# Altium project Drone_FCC.PrjPcb (part 2 of 2)

## Sheet Sensors.SchDoc
size A4; SheetNumber: 4; SheetTotal: 6
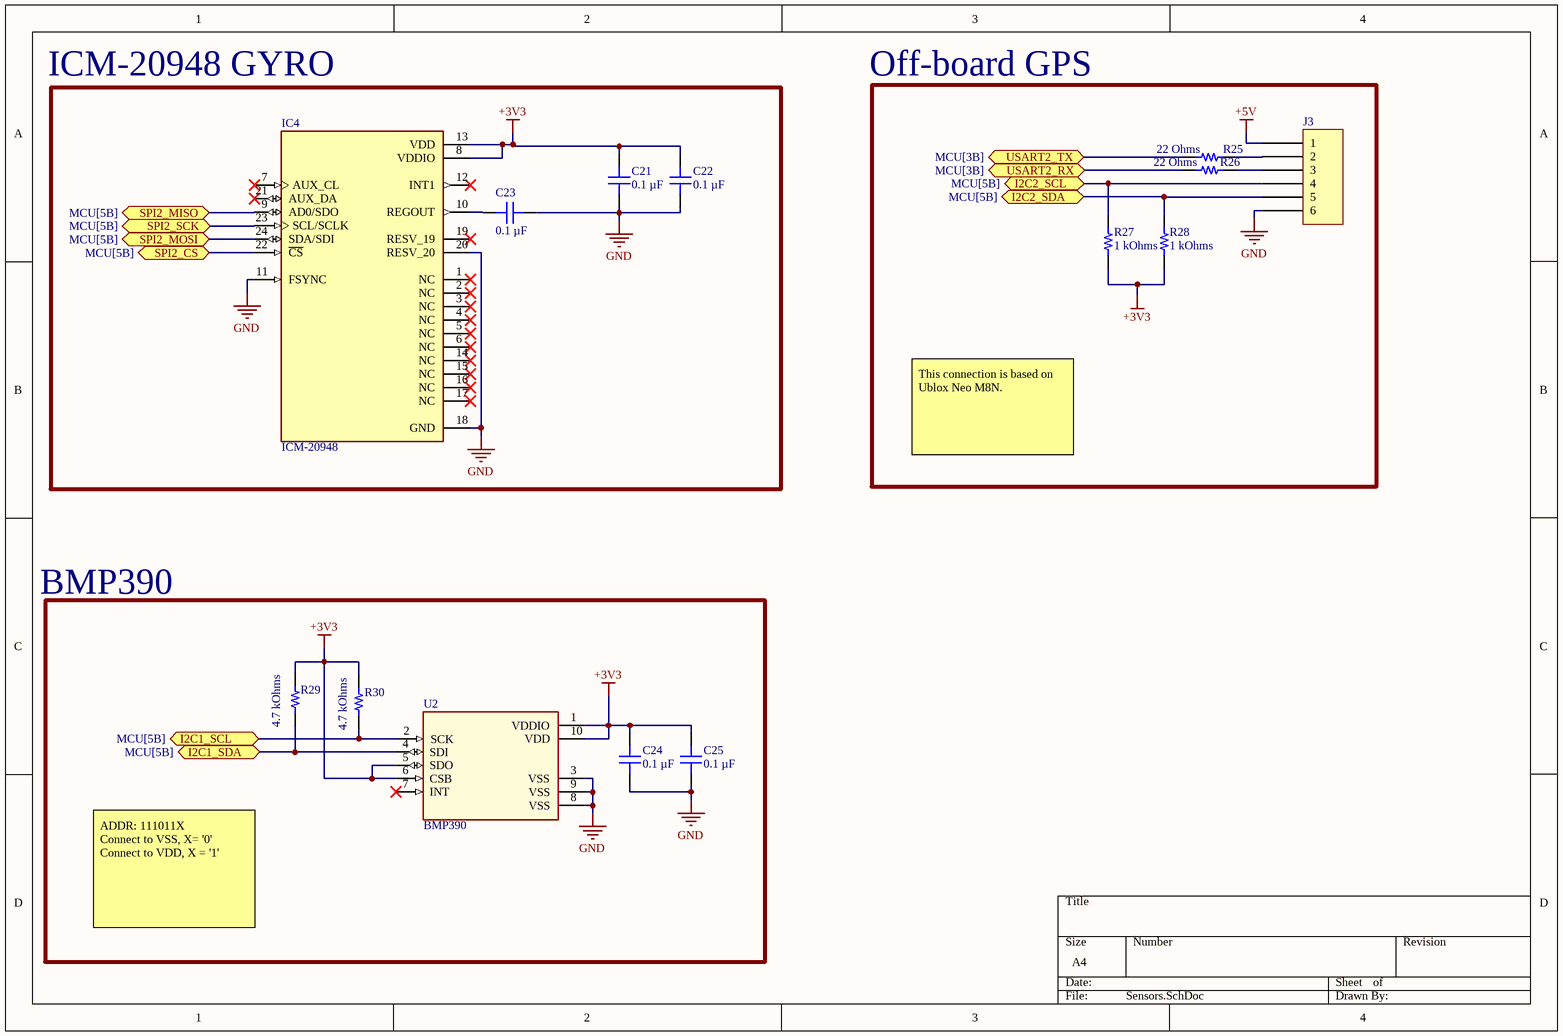
[diagram p3: Sensors.SchDoc]

### Parts
C21  0.1 µF  [CAP 0603_1608]
C22  0.1 µF  [CAP 0603_1608]
C23  0.1 µF  [CAP 0603_1608]
C24  0.1 µF  [CAP 0603_1608]
C25  0.1 µF  [CAP 0603_1608]
IC4  ICM-20948  [ICM-20948]
J3  SM06B-SRSS-TB(LF)(SN)  [JST SM06B-SRSS-TB]  (value not drawn)
R25  22 Ohms  [YAGEO RES 0402_1005]
R26  22 Ohms  [YAGEO RES 0402_1005]
R27  1 kOhms  [YAGEO RES 0402_1005]
R28  1 kOhms  [YAGEO RES 0402_1005]
R29  4.7 kOhms  [YAGEO RES 0402_1005]
R30  4.7 kOhms  [YAGEO RES 0402_1005]
U2  BMP390  [BMP390]

### Blocks framed on the sheet
Off-board GPS: J3 R25-R28
ICM-20948 GYRO: C21-C23 IC4

### Ports
I2C1_SCL (bidir, see MCU[5B]), I2C1_SDA (bidir, see MCU[5B]), I2C2_SCL (bidir, see MCU[5B]), I2C2_SDA (bidir, see MCU[5B]), SPI2_CS (bidir, see MCU[5B]), SPI2_MISO (bidir, see MCU[5B]), SPI2_MOSI (bidir, see MCU[5B]), SPI2_SCK (bidir, see MCU[5B]), USART2_RX (bidir, see MCU[3B]), USART2_TX (bidir, see MCU[3B])

### Nets
+3V3: C21.2 C22.2 C24.2 C25.2 IC4.8(VDDIO) IC4.13(VDD) R27.1 R28.1 R29.2 R30.2 U2.1(VDDIO) U2.5(SDO) U2.6(CSB) U2.10(VDD)
+5V: J3.1
GND: C21.1 C22.1 C23.1 C24.1 C25.1 IC4.11(FSYNC) IC4.18(GND) IC4.20(RESV_20) J3.6 U2.3(VSS) U2.8(VSS) U2.9(VSS)
I2C1_SCL: R30.1 U2.2(SCK) ; port I2C1_SCL
I2C1_SDA: R29.1 U2.4(SDI) ; port I2C1_SDA
I2C2_SCL: J3.4 R27.2 ; port I2C2_SCL
I2C2_SDA: J3.5 R28.2 ; port I2C2_SDA
SPI2_CS: IC4.22(~{CS}) ; port SPI2_CS
SPI2_MISO: IC4.9(AD0/SDO) ; port SPI2_MISO
SPI2_MOSI: IC4.24(SDA/SDI) ; port SPI2_MOSI
SPI2_SCK: IC4.23(SCL/SCLK) ; port SPI2_SCK
USART2_RX: R26.1 ; port USART2_RX
USART2_TX: R25.1 ; port USART2_TX
NetC23_2: C23.2 IC4.10(REGOUT)
NetJ3_2: J3.2 R25.2
NetJ3_3: J3.3 R26.2

Not connected (* = marked no-connect by the designer): IC4 1(NC)* 2(NC)* 3(NC)* 4(NC)* 5(NC)* 6(NC)* 7(AUX_CL)* 12(INT1)* 14(NC)* 15(NC)* 16(NC)* 17(NC)* 19(RESV_19)* 21(AUX_DA)*; U2 7(INT)*

### Notes on the sheet
- This connection is based on Ublox Neo M8N.
- BMP390
- ADDR: 111011X
  Connect to VSS, X= '0'
  Connect to VDD, X = '1'

### Library data of the parts
C21-C25 = GCJ188R71C104KA01D: CAP CER 0.1UF 16V X7R 0603; manufacturer: Murata Electronics; Tolerance: ±10%; Part Number: GCJ188R71C104KA01D; Capacitance: 0.1 µF; Applications: Automotive, Boardflex Sensitive; componentlink1description: Datasheet; componentlink1url: https://www.murata.com/~/media/webrenewal/support/library/catalog/products/capacitor/mlcc/c03e.ashx?la=en-us; componentlink2description: DigiKey Link; componentlink2url: https://www.digikey.com/en/products/detail/murata-electronics/GCJ188R71C104KA01D/2783813; Device Package: 0603 (1608 Metric); Features: Soft Termination; lastupdated: 9.02.2024 20:10:06; Lifecycle Status: Active; Minimum Order: 1; Mounting Type: Surface Mount, MLCC; Operating Temperature: -55°C ~ 125°C; Package / Case: 0603 (1608 Metric); packaging: TapeAndReel; partid: 17928; Part Status: Active; price: 0.02; Ratings: AEC-Q200; series: GCJ; Size / Dimension: 0.063" L x 0.031" W (1.60mm x 0.80mm); Supplier 1: DigiKey; Supplier Part Number 1: 490-5796-1-ND; Temperature Coefficient: X7R; Thickness (Max): 0.035" (0.90mm); value: 0.1 µF; Voltage - Rated: 16V
IC4 = ICM-20948: Accelerometer, Gyroscope, Magnetometer, 9 Axis Sensor I2C, SPI Output; Parameter 4: Package / Case; Sensor Type: Accelerometer, Gyroscope, Magnetometer, 9 Axis; Output Type: I2C, SPI; Operating Temperature: -40°C ~ 85°C
J3 = SM06B-SRSS-TB(LF)(SN): CONN HEADER SMD R/A 6POS 1MM; Manufacturer: JST Sales America Inc.; Current Rating (Amps): 0.7A; Material Flammability Rating: UL94 V-0; Number of Positions: 6; Number of Positions Loaded: All; Pitch - Mating: 0.039" (1.00mm); Shrouding: Shrouded - 4 Wall; Style: Board to Cable/Wire; Voltage Rating: 50V; Part Number: SM06B-SRSS-TB(LF)(SN); ComponentLink1Description: Datasheet; ComponentLink1URL: http://www.jst-mfg.com/product/pdf/eng/eSH.pdf; ComponentLink2Description: DigiKey Link; ComponentLink2URL: http://digikey.com/product-detail/en/jst-sales-america-inc/SM06B-SRSS-TB-LF-SN/455-1806-1-ND/926877; Connector Type: Header; Contact Finish - Mating: Tin; Contact Finish - Post: Tin; Contact Material: Copper Alloy; Contact Shape: Square; Contact Type: Male Pin; Fastening Type: Push-Pull; Features: Solder Retention; Insulation Color: Natural; Insulation Height: 0.114" (2.90mm); Insulation Material: Polyamide (PA), Nylon; LastUpdated: 12.01.2020 23:42:14; Lifecycle Status: Active; Minimum Order: 1; Mounting Type: Surface Mount, Right Angle; Number of Rows: 1; Operating Temperature: -25°C ~ 85°C; Packaging: TapeAndReel; PartId: 64; Part Status: Active; Price: 0.36; Series: SR; Supplier 1: DigiKey; Supplier Part Number 1: 455-1806-1-ND; Termination: Solder
R25 R26 = AC0402JR-0722RL: RES SMD 22 OHM 5% 1/16W 0402; Manufacturer: Yageo; Power (Watts): 0.063W, 1/16W; Temperature Coefficient: ±100ppm/°C; Part Number: AC0402JR-0722RL; Value: 22 Ohms; ComponentLink1Description: Datasheet; ComponentLink1URL: https://www.yageo.com/upload/media/product/productsearch/datasheet/rchip/PYu-AC_51_RoHS_L_7.pdf; ComponentLink2Description: DigiKey Link; ComponentLink2URL: https://www.digikey.com/en/products/detail/yageo/AC0402JR-0722RL/5895625; Composition: Thick Film; Device Package: 0402 (1005 Metric); Features: Automotive AEC-Q200, Moisture Resistant; Height - Seated (Max): 0.015" (0.37mm); LastUpdated: 25.07.2024 09:18:12; Lifecycle Status: Active; Minimum Order: 1; Number of Terminations: 2; Operating Temperature: -55°C ~ 155°C; Package / Case: 0402 (1005 Metric); Packaging: CutTape; PartId: 15641; Part Status: Active; Price: 0.01; Ratings: AEC-Q200; Resistance: 22 Ohms; Series: AC; Size / Dimension: 0.039" L x 0.020" W (1.00mm x 0.50mm); Supplier 1: DigiKey; Supplier Part Number 1: YAG3533CT-ND; Supplier Device Package: 0402; Tolerance: ±5%
R27 R28 = AC0402JR-071KL: RES SMD 1K OHM 5% 1/16W 0402; Manufacturer: Yageo; Power (Watts): 0.063W, 1/16W; Temperature Coefficient: ±100ppm/°C; Part Number: AC0402JR-071KL; Value: 1 kOhms; ComponentLink1Description: Datasheet; ComponentLink1URL: https://www.yageo.com/upload/media/product/productsearch/datasheet/rchip/PYu-AC_51_RoHS_L_7.pdf; ComponentLink2Description: DigiKey Link; ComponentLink2URL: https://www.digikey.com/en/products/detail/yageo/AC0402JR-071KL/5895603; Composition: Thick Film; Device Package: 0402 (1005 Metric); Features: Automotive AEC-Q200, Moisture Resistant; Height - Seated (Max): 0.015" (0.37mm); LastUpdated: 25.07.2024 09:18:18; Lifecycle Status: Active; Minimum Order: 1; Number of Terminations: 2; Operating Temperature: -55°C ~ 155°C; Package / Case: 0402 (1005 Metric); Packaging: CutTape; PartId: 3403; Part Status: Active; Price: 0.01; Ratings: AEC-Q200; Resistance: 1 kOhms; Series: AC; Size / Dimension: 0.039" L x 0.020" W (1.00mm x 0.50mm); Supplier 1: DigiKey; Supplier Part Number 1: YAG3525CT-ND; Supplier Device Package: 0402; Tolerance: ±5%
R29 R30 = RT0402FRE074K7L: RES SMD 4.7K OHM 1% 1/16W 0402; Manufacturer: Yageo; Power (Watts): 0.063W, 1/16W; Temperature Coefficient: ±50ppm/°C; Part Number: RT0402FRE074K7L; Value: 4.7 kOhms; ComponentLink1Description: Datasheet; ComponentLink1URL: https://www.yageo.com/upload/media/product/productsearch/datasheet/rchip/PYu-RT_1-to-0.01_RoHS_L_11.pdf; ComponentLink2Description: DigiKey Link; ComponentLink2URL: https://www.digikey.com/en/products/detail/yageo/RT0402FRE074K7L/1072052; Composition: Thin Film; Device Package: 0402 (1005 Metric); Height - Seated (Max): 0.014" (0.35mm); LastUpdated: 25.07.2024 09:18:18; Lifecycle Status: Active; Minimum Order: 1; Number of Terminations: 2; Operating Temperature: -55°C ~ 155°C; Package / Case: 0402 (1005 Metric); Packaging: TapeAndReel; PartId: 3198; Part Status: Active; Price: 0.01; Resistance: 4.7 kOhms; Series: RT; Size / Dimension: 0.039" L x 0.020" W (1.00mm x 0.50mm); Supplier 1: DigiKey; Supplier Part Number 1: YAG3347CT-ND; Supplier Device Package: 0402; Tolerance: ±1%
U2 = BMP390: Pressure Sensor 4.35PSI ~ 18.13PSI (30kPa ~ 125kPa) Absolute 10-WFLGA; Manufacturer: Bosch Sensortech; Output Type: I2C, SPI; Accuracy: ±0.01PSI (0.05kPa); Voltage Supply: 1.65V ~ 3.6V; Maximum Pressure: 290.08PSI (2000kPa); Operating Pressure: 4.35PSI ~ 18.13PSI (30kPa ~ 125kPa); Operating Temperature: -40°C ~ 85°C (TA); Package / Case: 10-WFLGA; ComponentLink1Description: Datasheet; ComponentLink1URL: https://www.bosch-sensortec.com/media/boschsensortec/downloads/datasheets/bst-bmp390-ds002.pdf; ComponentLink2Description: Digikey Link; ComponentLink2URL: https://www.digikey.com/en/products/detail/bosch-sensortec/bmp390/16164575

## Sheet MCU.SchDoc
size 350 x 200 mm; SheetNumber: 5; SheetTotal: 6
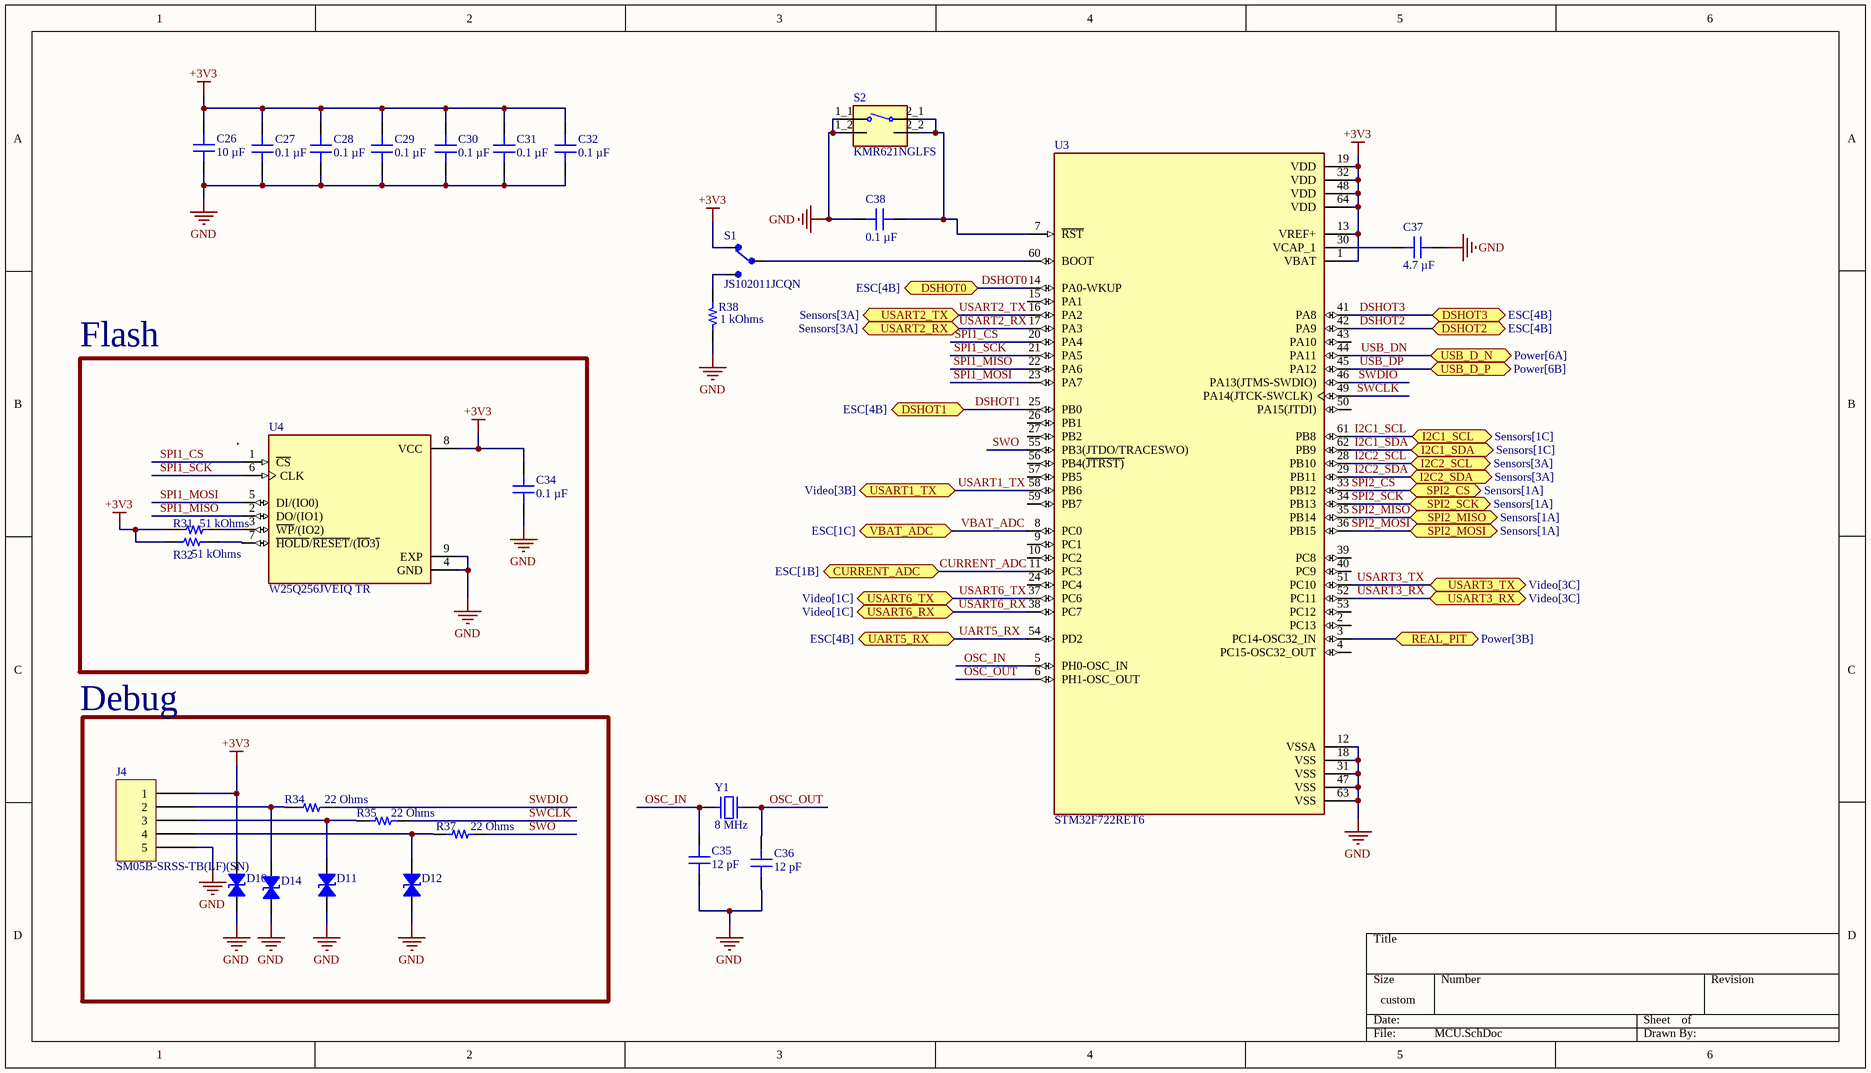
[diagram p4: MCU.SchDoc]

### Parts
C26  10 µF  [CAP 0402_1005]
C27  0.1 µF  [CAP 0402_1005]
C28  0.1 µF  [CAP 0402_1005]
C29  0.1 µF  [CAP 0402_1005]
C30  0.1 µF  [CAP 0402_1005]
C31  0.1 µF  [CAP 0402_1005]
C32  0.1 µF  [CAP 0402_1005]
C34  0.1 µF  [CAP 0603_1608]
C35  12 pF  [CAP 0402_1005]
C36  12 pF  [CAP 0402_1005]
C37  4.7 µF  [CAP 0402_1005]
C38  0.1 µF  [CAP 0402_1005]
D10  DESD5V0U1BA-7  [SOD323]  (value not drawn)
D11  DESD5V0U1BA-7  [SOD323]  (value not drawn)
D12  DESD5V0U1BA-7  [SOD323]  (value not drawn)
D14  DESD5V0U1BA-7  [SOD323]  (value not drawn)
J4  SM05B-SRSS-TB(LF)(SN)  [JST SM05B-SRSS-TB]
R31  51 kOhms  [RES 0603_1608]
R32  51 kOhms  [RES 0603_1608]
R34  22 Ohms  [YAGEO RES 0402_1005]
R35  22 Ohms  [YAGEO RES 0402_1005]
R37  22 Ohms  [YAGEO RES 0402_1005]
R38  1 kOhms  [YAGEO RES 0402_1005]
S1  JS102011JCQN  [JS102011JCQN]
S2  KMR621NGLFS  [KMR621NGLFS]
U3  STM32F722RET6  [STM32F722RET6]
U4  W25Q256JVEIQ TR  [W25Q256JVEIQ TR]
Y1  8 MHz  [NDK NX3225GD]

### Blocks framed on the sheet
Flash: C34 R31 R32 U4
Debug: D10-D12 D14 J4 R34 R35 R37

### Ports
CURRENT_ADC (bidir, see ESC[1B]), DSHOT0 (bidir, see ESC[4B]), DSHOT1 (bidir, see ESC[4B]), DSHOT2 (bidir, see ESC[4B]), DSHOT3 (bidir, see ESC[4B]), I2C1_SCL (bidir, see Sensors[1C]), I2C1_SDA (bidir, see Sensors[1C]), I2C2_SCL (bidir, see Sensors[3A]), I2C2_SDA (bidir, see Sensors[3A]), REAL_PIT (bidir, see Power[3B]), SPI2_CS (bidir, see Sensors[1A]), SPI2_MISO (bidir, see Sensors[1A]), SPI2_MOSI (bidir, see Sensors[1A]), SPI2_SCK (bidir, see Sensors[1A]), UART5_RX (bidir, see ESC[4B]), USART1_TX (bidir, see Video[3B]), USART2_RX (bidir, see Sensors[3A]), USART2_TX (bidir, see Sensors[3A]), USART3_RX (bidir, see Video[3C]), USART3_TX (bidir, see Video[3C]), USART6_RX (bidir, see Video[1C]), USART6_TX (bidir, see Video[1C]), USB_D_N (bidir, see Power[6A]), USB_D_P (bidir, see Power[6B]), VBAT_ADC (bidir, see ESC[1C])

### Nets
+3V3: C26.2 C27.2 C28.2 C29.2 C30.2 C31.2 C32.2 C34.2 D10.2 J4.1 R31.2 R32.2 S1.1 U3.1(VBAT) U3.13(VREF+) U3.19(VDD) U3.32(VDD) U3.48(VDD) U3.64(VDD) U4.8(VCC)
GND: C26.1 C27.1 C28.1 C29.1 C30.1 C31.1 C32.1 C34.1 C35.1 C36.1 C37.2 C38.1 D10.1 D11.1 D12.1 D14.1 J4.5 R38.2 S2.1_1 S2.1_2 U3.12(VSSA) U3.18(VSS) U3.31(VSS) U3.47(VSS) U3.63(VSS) U4.4(GND) U4.9(EXP)
CURRENT_ADC: U3.11(PC3) ; port CURRENT_ADC
DSHOT0: U3.14(PA0-WKUP) ; port DSHOT0
DSHOT1: U3.25(PB0) ; port DSHOT1
DSHOT2: U3.42(PA9) ; port DSHOT2
DSHOT3: U3.41(PA8) ; port DSHOT3
I2C1_SCL: U3.61(PB8) ; port I2C1_SCL
I2C1_SDA: U3.62(PB9) ; port I2C1_SDA
I2C2_SCL: U3.28(PB10) ; port I2C2_SCL
I2C2_SDA: U3.29(PB11) ; port I2C2_SDA
OSC_IN: C35.2 U3.5(PH0-OSC_IN) Y1.1
OSC_OUT: C36.2 U3.6(PH1-OSC_OUT) Y1.2
SPI1_CS: U3.20(PA4) U4.1(~{CS})
SPI1_MISO: U3.22(PA6) U4.2(DO/(IO1))
SPI1_MOSI: U3.23(PA7) U4.5(DI/(IO0))
SPI1_SCK: U3.21(PA5) U4.6(CLK)
SPI2_CS: U3.33(PB12) ; port SPI2_CS
SPI2_MISO: U3.35(PB14) ; port SPI2_MISO
SPI2_MOSI: U3.36(PB15) ; port SPI2_MOSI
SPI2_SCK: U3.34(PB13) ; port SPI2_SCK
SWCLK: R35.2 U3.49(PA14(JTCK-SWCLK))
SWDIO: R34.2 U3.46(PA13(JTMS-SWDIO))
SWO: R37.2 U3.55(PB3(JTDO/TRACESWO))
UART5_RX: U3.54(PD2) ; port UART5_RX
USART1_TX: U3.58(PB6) ; port USART1_TX
USART2_RX: U3.17(PA3) ; port USART2_RX
USART2_TX: U3.16(PA2) ; port USART2_TX
USART3_RX: U3.52(PC11) ; port USART3_RX
USART3_TX: U3.51(PC10) ; port USART3_TX
USART6_RX: U3.38(PC7) ; port USART6_RX
USART6_TX: U3.37(PC6) ; port USART6_TX
USB_DN: U3.44(PA11) ; port USB_D_N  [project net USB_D_N]
USB_DP: U3.45(PA12) ; port USB_D_P  [project net USB_D_P]
VBAT_ADC: U3.8(PC0) ; port VBAT_ADC
NetC37_1: C37.1 U3.30(VCAP_1)
NetC38_2: C38.2 S2.2_1 S2.2_2 U3.7(~{RST})
NetD11_2: D11.2 J4.3 R35.1
NetD12_2: D12.2 J4.4 R37.1
NetD14_2: D14.2 J4.2 R34.1
NetR6_1: U3.3(PC14-OSC32_IN) ; port REAL_PIT
NetR31_1: R31.1 U4.3(~{WP}/(IO2))
NetR32_1: R32.1 U4.7(~{HOLD}/~{RESET}/(~{IO}3~{)})
NetR38_1: R38.1 S1.3
NetS1_2: S1.2 U3.60(BOOT)

Not connected (* = marked no-connect by the designer): U3 2(PC13) 4(PC15-OSC32_OUT) 9(PC1) 10(PC2) 15(PA1) 24(PC4) 26(PB1) 27(PB2) 39(PC8) 40(PC9) 43(PA10) 50(PA15(JTDI)) 53(PC12) 56(PB4(~{JTRST)}) 57(PB5) 59(PB7)

### Library data of the parts
C26 = CL05A106MQ5NUNC: CAP CER 10UF 6.3V X5R 0402; manufacturer: Samsung Electro-Mechanics; Tolerance: ±20%; Part Number: CL05A106MQ5NUNC; Capacitance: 10 µF; Applications: General Purpose; componentlink1description: Datasheet; componentlink1url: http://www.samsungsem.com/kr/support/product-search/mlcc/CL05A106MQ5NUNC.jsp; componentlink2description: DigiKey Link; componentlink2url: https://www.digikey.com/en/products/detail/samsung-electro-mechanics/CL05A106MQ5NUNC/3887109; Device Package: 0402 (1005 Metric); lastupdated: 9.02.2024 20:04:38; Lifecycle Status: Active; Minimum Order: 1; Mounting Type: Surface Mount, MLCC; Operating Temperature: -55°C ~ 85°C; Package / Case: 0402 (1005 Metric); packaging: TapeAndReel; partid: 1766; Part Status: Active; price: 0.03; series: CL; Size / Dimension: 0.039" L x 0.020" W (1.00mm x 0.50mm); Supplier 1: DigiKey; Supplier Part Number 1: 1276-1451-1-ND; Temperature Coefficient: X5R; Thickness (Max): 0.028" (0.70mm); value: 10 µF; Voltage - Rated: 6.3V
C27-C32 C38 = CC0402MRX5R5BB104: CAP CER 0.1UF 6.3V X5R 0402; manufacturer: Yageo; Tolerance: ±20%; Part Number: CC0402MRX5R5BB104; Capacitance: 0.1 µF; Applications: General Purpose; componentlink1description: Datasheet; componentlink1url: https://www.yageo.com/upload/media/product/productsearch/datasheet/mlcc/UPY-GPHC_X5R_4V-to-50V_25.pdf; componentlink2description: DigiKey Link; componentlink2url: https://www.digikey.com/en/products/detail/yageo/CC0402MRX5R5BB104/5883384; Device Package: 0402 (1005 Metric); lastupdated: 9.02.2024 20:04:37; Lifecycle Status: Active; Minimum Order: 10; Mounting Type: Surface Mount, MLCC; Operating Temperature: -55°C ~ 85°C; Package / Case: 0402 (1005 Metric); packaging: CutTape; partid: 1960; Part Status: Active; price: 0.01; series: CC; Size / Dimension: 0.039" L x 0.020" W (1.00mm x 0.50mm); Supplier 1: DigiKey; Supplier Part Number 1: 311-3818-1-ND; Temperature Coefficient: X5R; Thickness (Max): 0.022" (0.55mm); value: 0.1 µF; Voltage - Rated: 6.3V
C34 = CL10B104KB8NNNC: CAP CER 0.1UF 50V X7R 0603; manufacturer: Samsung Electro-Mechanics; Tolerance: ±10%; Part Number: CL10B104KB8NNNC; Capacitance: 0.1 µF; Applications: General Purpose; componentlink1description: Datasheet; componentlink1url: http://www.samsungsem.com/kr/support/product-search/mlcc/CL10B104KB8NNNC.jsp; componentlink2description: DigiKey Link; componentlink2url: https://www.digikey.com/en/products/detail/samsung-electro-mechanics/CL10B104KB8NNNC/3886658; Device Package: 0603 (1608 Metric); lastupdated: 9.02.2024 20:10:20; Lifecycle Status: Active; Minimum Order: 1; Mounting Type: Surface Mount, MLCC; Operating Temperature: -55°C ~ 125°C; Package / Case: 0603 (1608 Metric); packaging: TapeAndReel; partid: 9788; Part Status: Active; price: 0.01; series: CL; Size / Dimension: 0.063" L x 0.031" W (1.60mm x 0.80mm); Supplier 1: DigiKey; Supplier Part Number 1: 1276-1000-1-ND; Temperature Coefficient: X7R; Thickness (Max): 0.035" (0.90mm); value: 0.1 µF; Voltage - Rated: 50V
C35 C36 = C0402C120J8GAC7867: CAP CER 12PF 10V NP0 0402; manufacturer: KEMET; Temperature Coefficient: C0G, NP0; Tolerance: ±5%; Part Number: C0402C120J8GAC7867; Capacitance: 12 pF; Applications: General Purpose; componentlink1description: Datasheet; componentlink1url: https://api.kemet.com/component-edge/download/datasheet/C0402C120J8GACTU.pdf; componentlink2description: DigiKey Link; componentlink2url: https://www.digikey.com/en/products/detail/kemet/C0402C120J8GAC7867/2196270; Device Package: 0402 (1005 Metric); Features: Low ESL; lastupdated: 9.02.2024 20:04:28; Lifecycle Status: Active; Minimum Order: 1; Mounting Type: Surface Mount, MLCC; Operating Temperature: -55°C ~ 125°C; Package / Case: 0402 (1005 Metric); packaging: TapeAndReel; partid: 7556; Part Status: Active; price: 0.05; series: SMD Comm C0G; Size / Dimension: 0.039" L x 0.020" W (1.00mm x 0.50mm); Supplier 1: DigiKey; Supplier Part Number 1: 399-14417-1-ND; Thickness (Max): 0.022" (0.55mm); value: 12 pF; Voltage - Rated: 10V
C37 = C1005X5R0J475K050BC: CAP CER 4.7UF 6.3V X5R 0402; manufacturer: TDK Corporation; Tolerance: ±10%; Part Number: C1005X5R0J475K050BC; Capacitance: 4.7 µF; Applications: General Purpose; componentlink1description: Datasheet; componentlink1url: https://product.tdk.com/info/en/catalog/datasheets/mlcc_commercial_general_en.pdf?ref_disty=digikey; componentlink2description: DigiKey Link; componentlink2url: https://www.digikey.com/en/products/detail/tdk-corporation/C1005X5R0J475K050BC/2443425; Device Package: 0402 (1005 Metric); Features: Low ESL; lastupdated: 9.02.2024 20:04:37; Lifecycle Status: Active; Minimum Order: 1; Mounting Type: Surface Mount, MLCC; Operating Temperature: -55°C ~ 85°C; Package / Case: 0402 (1005 Metric); packaging: TapeAndReel; partid: 2194; Part Status: Active; price: 0.06; series: C; Size / Dimension: 0.039" L x 0.020" W (1.00mm x 0.50mm); Supplier 1: DigiKey; Supplier Part Number 1: 445-5947-1-ND; Temperature Coefficient: X5R; Thickness (Max): 0.026" (0.65mm); value: 4.7 µF; Voltage - Rated: 6.3V
D10-D12 D14 = DESD5V0U1BA-7: TVS DIODE 5VWM 7.2VC SOD323; Manufacturer: Diodes Incorporated; Bidirectional Channels: 1; Capacitance @ Frequency: 2.9pF @ 1MHz; Current - Peak Pulse (10/1000µs): 3A (8/20µs); Power Line Protection: No; Type: Zener; Voltage - Breakdown (Min): 5.5V; Voltage - Clamping (Max) @ Ipp: 7.2V (Typ); Voltage - Reverse Standoff (Typ): 5V (Max); Part Number: DESD5V0U1BA-7; Applications: General Purpose; ComponentLink1Description: Datasheet; ComponentLink1URL: https://www.diodes.com/assets/Datasheets/DESD5V0U1BA.pdf; ComponentLink2Description: DigiKey Link; ComponentLink2URL: https://www.digikey.com/en/products/detail/diodes-incorporated/DESD5V0U1BA-7/5371876; LastUpdated: 3.06.2024 20:22:28; Lifecycle Status: Active; Minimum Order: 1; Mounting Type: Surface Mount; Operating Temperature: -65°C ~ 150°C (TJ); Package / Case: SC-76, SOD-323; Packaging: TapeAndReel; PartId: 9987; Part Status: Active; Price: 0.02; Series: -; Supplier 1: DigiKey; Supplier Part Number 1: DESD5V0U1BA-7DICT-ND; Supplier Device Package: SOD-323
J4 = SM05B-SRSS-TB(LF)(SN): CONN HEADER SMD R/A 5POS 1MM; Manufacturer: JST Sales America Inc.; Current Rating (Amps): 0.7A; Material Flammability Rating: UL94 V-0; Number of Positions: 5; Number of Positions Loaded: All; Pitch - Mating: 0.039" (1.00mm); Shrouding: Shrouded - 4 Wall; Style: Board to Cable/Wire; Voltage Rating: 50V; Part Number: SM05B-SRSS-TB(LF)(SN); ComponentLink1Description: Datasheet; ComponentLink1URL: http://www.jst-mfg.com/product/pdf/eng/eSH.pdf; ComponentLink2Description: DigiKey Link; ComponentLink2URL: http://digikey.com/product-detail/en/jst-sales-america-inc/SM05B-SRSS-TB-LF-SN/455-1805-1-ND/926876; Connector Type: Header; Contact Finish - Mating: Tin; Contact Finish - Post: Tin; Contact Material: Copper Alloy; Contact Shape: Square; Contact Type: Male Pin; Fastening Type: Push-Pull; Features: Solder Retention; Insulation Color: Natural; Insulation Height: 0.114" (2.90mm); Insulation Material: Polyamide (PA), Nylon; LastUpdated: 12.01.2020 23:42:04; Lifecycle Status: Active; Minimum Order: 1; Mounting Type: Surface Mount, Right Angle; Number of Rows: 1; Operating Temperature: -25°C ~ 85°C; Packaging: TapeAndReel; PartId: 63; Part Status: Active; Price: 0.32; Series: SR; Supplier 1: DigiKey; Supplier Part Number 1: 455-1805-1-ND; Termination: Solder
R31 R32 = CRCW060351K0FKEAHP: RES SMD 51K OHM 1% 1/3W 0603; Manufacturer: Vishay Dale; Power (Watts): 0.333W, 1/3W; Temperature Coefficient: ±100ppm/°C; Part Number: CRCW060351K0FKEAHP; Value: 51 kOhms; ComponentLink1Description: Datasheet; ComponentLink1URL: https://www.vishay.com/docs/20043/crcwhpe3.pdf; ComponentLink2Description: DigiKey Link; ComponentLink2URL: https://www.digikey.com/en/products/detail/vishay-dale/CRCW060351K0FKEAHP/2226362; Composition: Thick Film; Device Package: 0603 (1608 Metric); Features: Automotive AEC-Q200, Pulse Withstanding; Height - Seated (Max): 0.022" (0.55mm); LastUpdated: 9.02.2024 20:41:01; Lifecycle Status: Active; Minimum Order: 1; Number of Terminations: 2; Operating Temperature: -55°C ~ 155°C; Package / Case: 0603 (1608 Metric); Packaging: TapeAndReel; PartId: 71937; Part Status: Active; Price: 0.02; Ratings: AEC-Q200; Resistance: 51 kOhms; Series: CRCW-HP; Size / Dimension: 0.063" L x 0.033" W (1.60mm x 0.85mm); Supplier 1: DigiKey; Supplier Part Number 1: 541-CRCW060351K0FKEAHPCT-ND; Supplier Device Package: 0603; Tolerance: ±1%
R34 R35 R37 = AC0402JR-0722RL: as R25 on sheet Sensors; Part Number: AC0402JR-0722RL; Value: 22 Ohms; ComponentLink1Description: Datasheet; ComponentLink1URL: https://www.yageo.com/upload/media/product/productsearch/datasheet/rchip/PYu-AC_51_RoHS_L_7.pdf; ComponentLink2Description: DigiKey Link; ComponentLink2URL: https://www.digikey.com/en/products/detail/yageo/AC0402JR-0722RL/5895625; Composition: Thick Film; Device Package: 0402 (1005 Metric); Features: Automotive AEC-Q200, Moisture Resistant; Height - Seated (Max): 0.015" (0.37mm); LastUpdated: 25.07.2024 09:18:12; Lifecycle Status: Active; Minimum Order: 1; Number of Terminations: 2; Operating Temperature: -55°C ~ 155°C; Package / Case: 0402 (1005 Metric); Packaging: CutTape; PartId: 15641; Part Status: Active; Price: 0.01; Ratings: AEC-Q200; Resistance: 22 Ohms; Series: AC; Size / Dimension: 0.039" L x 0.020" W (1.00mm x 0.50mm); Supplier 1: DigiKey; Supplier Part Number 1: YAG3533CT-ND; Supplier Device Package: 0402; Tolerance: ±5%
R38 = RT0402BRE071KL: RES SMD 1K OHM 0.1% 1/16W 0402; Manufacturer: Yageo; Power (Watts): 0.063W, 1/16W; Temperature Coefficient: ±50ppm/°C; Part Number: RT0402BRE071KL; Value: 1 kOhms; ComponentLink1Description: Datasheet; ComponentLink1URL: https://www.yageo.com/upload/media/product/productsearch/datasheet/rchip/PYu-RT_1-to-0.01_RoHS_L_11.pdf; ComponentLink2Description: DigiKey Link; ComponentLink2URL: https://www.digikey.com/en/products/detail/yageo/RT0402BRE071KL/1069571; Composition: Thin Film; Device Package: 0402 (1005 Metric); Height - Seated (Max): 0.014" (0.35mm); LastUpdated: 25.07.2024 09:18:18; Lifecycle Status: Active; Minimum Order: 1; Number of Terminations: 2; Operating Temperature: -55°C ~ 155°C; Package / Case: 0402 (1005 Metric); Packaging: TapeAndReel; PartId: 3163; Part Status: Active; Price: 0.04; Resistance: 1 kOhms; Series: RT; Size / Dimension: 0.039" L x 0.020" W (1.00mm x 0.50mm); Supplier 1: DigiKey; Supplier Part Number 1: YAG2306CT-ND; Supplier Device Package: 0402; Tolerance: ±0.1%
S1 = JS102011JCQN: SWITCH SLIDE SPDT 300MA 6V; Manufacturer: C&K; Contact Timing: Not Specified; Current Rating (Amps): 300mA (DC); Switch Function: On-On; Actuator Type: Standard; Actuator Length: 2.00mm; Actuator Material: Polyamide (PA46), Nylon 4/6; Electrical Life: 5,000 Cycles; ComponentLink1Description: Datasheet; ComponentLink1URL: https://www.ckswitches.com/media/1422/js.pdf; ComponentLink2Description: Digikey Link; ComponentLink2URL: https://www.digikey.com/en/products/detail/c-k/JS102011JCQN/6137628; Circuit: SPDT; Voltage Rating - DC: 6V; Contact Material: Copper Alloy; Contact Finish: Silver; Mounting Type: Surface Mount; Termination Style: J Lead; Operating Temperature: -40°C ~ 85°C; Switch Travel: 2.00mm
S2 = KMR621NGLFS: SWITCH TACTILE SPST-NO 0.05A 32V; Manufacturer: C&K; Mechanical Life: 200,000 Cycles; Ingress Protection: IP67 - Dust Tight, Waterproof; Operating Force: 200gf; Illumination: Non-Illuminated; Outline: 4.20mm x 2.80mm; Actuator Orientation: Top Actuated; Actuator Height off PCB, Vertical: 1.90mm; Actuator Type: Standard; Contact Rating @ Voltage: 0.05A @ 32VDC; Switch Function: Off-Mom; ComponentLink1Description: Datasheet; ComponentLink1URL: https://www.ckswitches.com/media/1907/kmr6.pdf; ComponentLink2Description: Digikey Link; ComponentLink2URL: https://www.digikey.com/en/products/detail/c-k/KMR621NG-LFS/6035350; Operating Temperature: -40°C ~ 85°C; Termination Style: Gull Wing; Mounting Type: Surface Mount; Circuit: SPST-NO
U3 = STM32F722RET6: ARM® Cortex®-M7 STM32F7 Microcontroller IC 32-Bit Single-Core 216MHz 512KB (512K x 8) FLASH 64-LQFP (10x10); Manufacturer: STMicroelectronics; Connectivity: CANbus, I2C, IrDA, LINbus, MMC/SD, QSPI, SAI, SPI, UART/USART, USB; Number of I/O: 50; Peripherals: Brown-out Detect/Reset, DMA, I2S, POR, PWM, WDT; RAM Size: 256K x 8; Voltage - Supply (Vcc/Vdd): 1.7V ~ 3.6V; Data Converters: A/D 16x12b; D/A 2x12b; Oscillator Type: Internal; ComponentLink1Description: Datasheet; ComponentLink1URL: https://www.st.com/content/ccc/resource/technical/document/datasheet/group3/d6/11/13/15/f4/38/49/79/DM00330506/files/DM00330506.pdf/jcr:content/translations/en.DM00330506.pdf; ComponentLink2Description: Digikey Link; ComponentLink2URL: https://www.digikey.com/en/products/detail/stmicroelectronics/STM32F722RET6/6621769; Core Processor: ARM® Cortex®-M7; Core Size: 32-Bit Single-Core; Speed: 216MHz; Program Memory Size: 512KB (512K x 8); Program Memory Type: FLASH; Operating Temperature: -40°C ~ 85°C (TA); Supplier Device Package: 64-LQFP (10x10)
U4 = W25Q256JVEIQ TR: FLASH - NOR Memory IC 256Mbit SPI - Quad I/O 133 MHz 8-WSON (8x6); Manufacturer: Winbond Electronics; Memory Type: Non-Volatile; Memory Organization: 32M x 8; Clock Frequency: 133 MHz; Write Cycle Time - Word, Page: 3ms; Voltage - Supply: 2.7V ~ 3.6V; ComponentLink1Description: Datasheet; ComponentLink1URL: https://www.winbond.com/resource-files/w25q256jv%20spi%20revg%2008032017.pdf; ComponentLink2Description: Digikey Link; ComponentLink2URL: https://www.digikey.com/en/products/detail/winbond-electronics/w25q256jveiq-tr/5803969; Memory Format: FLASH; Technology: FLASH - NOR; Memory Size: 256Mbit; Memory Interface: SPI - Quad I/O; Operating Temperature: -40°C ~ 85°C (TA); Mounting Type: Surface Mount; Supplier Device Package: 8-WSON (8x6)
Y1 = NX3225GD-8MHZ-STD-CRA-3: CRYSTAL 8.0000MHZ 8PF SMD; Manufacturer: NDK America, Inc.; ESR (Equivalent Series Resistance): 500 Ohms; Frequency Stability: ±150ppm; Frequency Tolerance: ±50ppm; Operating Mode: Fundamental; Part Number: NX3225GD-8MHZ-STD-CRA-3; ComponentLink1Description: Datasheet; ComponentLink1URL: http://www.ndk.com/images/products/catalog/c_NX3225GD-STD-CRA-3_e.pdf; ComponentLink2Description: DigiKey Link; ComponentLink2URL: https://www.digikey.com/en/products/detail/ndk-america-inc/NX3225GD-8MHZ-STD-CRA-3/3125637; Frequency: 8 MHz; Height - Seated (Max): 0.039" (1.00mm); LastUpdated: 3.06.2024 20:17:11; Lifecycle Status: Active; Load Capacitance: 8pF; Minimum Order: 1; Mounting Type: Surface Mount; Operating Temperature: -40°C ~ 150°C; Package / Case: 2-SMD, No Lead; Packaging: TapeAndReel; PartId: 744; Part Status: Active; Price: 0.48; Ratings: AEC-Q200; Series: NX3225GD; Size / Dimension: 0.126" L x 0.098" W (3.20mm x 2.50mm); Supplier 1: DigiKey; Supplier Part Number 1: 644-1178-1-ND; Type: MHz Crystal; Value: 8 MHz

## Sheet Video.SchDoc
size A4; SheetNumber: 6; SheetTotal: 6
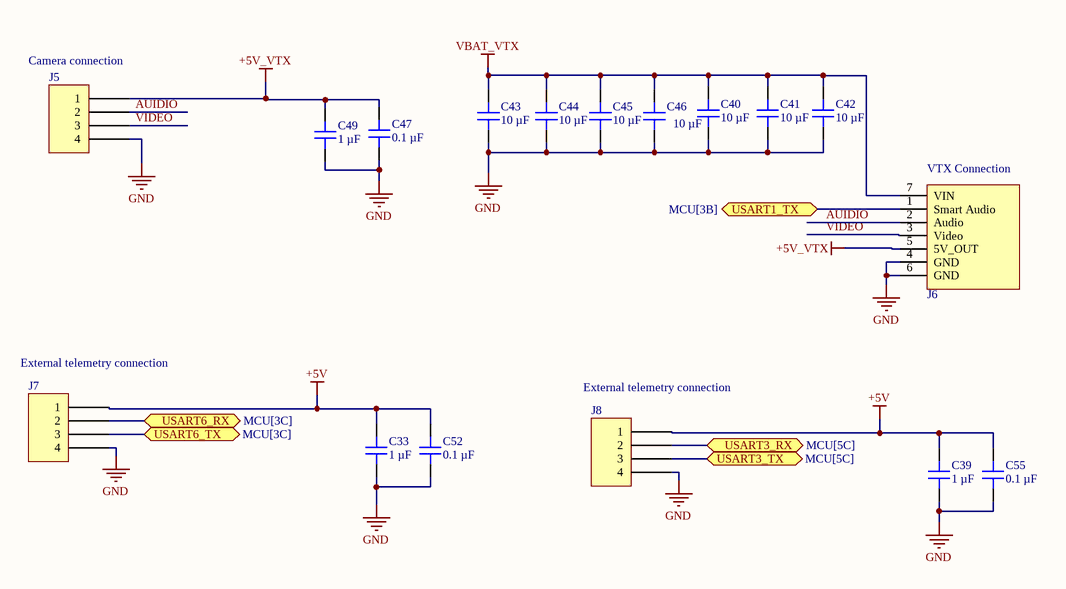
[diagram p5: Video.SchDoc]

### Parts
C33  1 µF  [CAP 0402_1005]
C39  1 µF  [CAP 0402_1005]
C40  10 µF  [MURATA GRM188 0603_1608]
C41  10 µF  [MURATA GRM188 0603_1608]
C42  10 µF  [MURATA GRM188 0603_1608]
C43  10 µF  [MURATA GRM188 0603_1608]
C44  10 µF  [MURATA GRM188 0603_1608]
C45  10 µF  [MURATA GRM188 0603_1608]
C46  10 µF  [MURATA GRM188 0603_1608]
C47  0.1 µF  [CAP 0402_1005]
C49  1 µF  [CAP 0402_1005]
C52  0.1 µF  [CAP 0402_1005]
C55  0.1 µF  [CAP 0402_1005]
J5  DF13A-4P-1.25H(75)  [HIROSE DF13A-4P-1.25H]  (value not drawn)
J6  TBS Unify PRO32 HV 5G8  [TBS Unify Pro 5G8 HV Race]  (value not drawn)
J7  DF13A-4P-1.25H(75)  [HIROSE DF13A-4P-1.25H]  (value not drawn)
J8  DF13A-4P-1.25H(75)  [HIROSE DF13A-4P-1.25H]  (value not drawn)

### Ports
USART1_TX (bidir, see MCU[3B]), USART3_RX (bidir, see MCU[5C]), USART3_TX (bidir, see MCU[5C]), USART6_RX (bidir, see MCU[3C]), USART6_TX (bidir, see MCU[3C])

### Nets
+5V: C33.2 C39.2 C52.2 C55.2 J7.1 J8.1
+5V_VTX: C47.2 C49.2 J5.1 J6.5(5V_OUT)
GND: C33.1 C39.1 C40.1 C41.1 C42.1 C43.1 C44.1 C45.1 C46.1 C47.1 C49.1 C52.1 C55.1 J5.4 J6.4(GND) J6.6(GND) J7.4 J8.4
VBAT_VTX: C40.2 C41.2 C42.2 C43.2 C44.2 C45.2 C46.2 J6.7(VIN)
AUIDIO: J5.2 J6.2(Audio)
USART1_TX: J6.1(Smart_Audio) ; port USART1_TX
USART3_RX: J8.2 ; port USART3_RX
USART3_TX: J8.3 ; port USART3_TX
USART6_RX: J7.2 ; port USART6_RX
USART6_TX: J7.3 ; port USART6_TX
VIDEO: J5.3 J6.3(Video)

### Notes on the sheet
- (near J5) Camera connection
- (near J6) VTX Connection
- (near J7) External telemetry connection
- (near J8) External telemetry connection

### Library data of the parts
C33 C39 C49 = GMC04X7R105K6R3NT: CAP0402 X7R 1UF 10% 6.3V; manufacturer: Cal-Chip Electronics, Inc.; Part Number: GMC04X7R105K6R3NT; Capacitance: 1 µF; Applications: General Purpose; componentlink1description: Datasheet; componentlink1url: https://88ce57.p3cdn1.secureserver.net/wp-content/uploads/2023/01/gmc_series-2.pdf; componentlink2description: DigiKey Link; componentlink2url: https://www.digikey.com/en/products/detail/cal-chip-electronics-inc/GMC04X7R105K6R3NT/18151100; Device Package: 0402 (1005 Metric); lastupdated: 9.02.2024 20:03:58; Lifecycle Status: Active; Minimum Order: 1; Mounting Type: Surface Mount, MLCC; Operating Temperature: -55°C ~ 125°C; Package / Case: 0402 (1005 Metric); packaging: TapeAndReel; partid: 49820; Part Status: Active; price: 0.01; series: GMC; Size / Dimension: 0.039" L x 0.020" W (1.00mm x 0.50mm); Supplier 1: DigiKey; Supplier Part Number 1: 4713-GMC04X7R105K6R3NTCT-ND; Temperature Coefficient: X7R; Thickness (Max): 0.022" (0.55mm); Tolerance: ±10%; value: 1 µF; Voltage - Rated: 6.3V
C40-C46 = GRM188R61E106KA73D: CAP CER 10UF 25V X5R 0603; manufacturer: Murata Electronics; Tolerance: ±10%; Part Number: GRM188R61E106KA73D; Capacitance: 10 µF; Applications: General Purpose; componentlink1description: Datasheet; componentlink1url: https://search.murata.co.jp/Ceramy/image/img/A01X/G101/ENG/GRM188R61E106KA73-01.pdf; componentlink2description: DigiKey Link; componentlink2url: https://www.digikey.com/en/products/detail/murata-electronics/GRM188R61E106KA73D/9867922; Device Package: 0603 (1608 Metric); lastupdated: 20.07.2024 00:23:20; Lifecycle Status: Active; Minimum Order: 1; Mounting Type: Surface Mount, MLCC; Operating Temperature: -55°C ~ 85°C; Package / Case: 0603 (1608 Metric); packaging: TapeAndReel; partid: 12669; Part Status: Active; price: 0.04; series: GRM; Size / Dimension: 0.063" L x 0.031" W (1.60mm x 0.80mm); Supplier 1: DigiKey; Supplier Part Number 1: 490-18214-1-ND; Temperature Coefficient: X5R; Thickness (Max): 0.039" (1.00mm); value: 10 µF; Voltage - Rated: 25V
C47 C52 C55 = CC0402MRX5R5BB104: as C27 on sheet MCU; Part Number: CC0402MRX5R5BB104; Capacitance: 0.1 µF; Applications: General Purpose; componentlink1description: Datasheet; componentlink1url: https://www.yageo.com/upload/media/product/productsearch/datasheet/mlcc/UPY-GPHC_X5R_4V-to-50V_25.pdf; componentlink2description: DigiKey Link; componentlink2url: https://www.digikey.com/en/products/detail/yageo/CC0402MRX5R5BB104/5883384; Device Package: 0402 (1005 Metric); lastupdated: 9.02.2024 20:04:37; Lifecycle Status: Active; Minimum Order: 10; Mounting Type: Surface Mount, MLCC; Operating Temperature: -55°C ~ 85°C; Package / Case: 0402 (1005 Metric); packaging: CutTape; partid: 1960; Part Status: Active; price: 0.01; series: CC; Size / Dimension: 0.039" L x 0.020" W (1.00mm x 0.50mm); Supplier 1: DigiKey; Supplier Part Number 1: 311-3818-1-ND; Temperature Coefficient: X5R; Thickness (Max): 0.022" (0.55mm); value: 0.1 µF; Voltage - Rated: 6.3V
J5 J7 J8 = SM04B-SRSS-TB(LF)(SN): CONN HEADER SMD R/A 4POS 1MM; Manufacturer: JST Sales America Inc.; Current Rating (Amps): 0.7A; Material Flammability Rating: UL94 V-0; Number of Positions: 4; Number of Positions Loaded: All; Pitch - Mating: 0.039" (1.00mm); Shrouding: Shrouded - 4 Wall; Style: Board to Cable/Wire; Voltage Rating: 50V; Part Number: SM04B-SRSS-TB(LF)(SN); ComponentLink1Description: Datasheet; ComponentLink1URL: http://www.jst-mfg.com/product/pdf/eng/eSH.pdf; ComponentLink2Description: DigiKey Link; ComponentLink2URL: http://digikey.com/product-detail/en/jst-sales-america-inc/SM04B-SRSS-TB-LF-SN/455-1804-1-ND/926875; Connector Type: Header; Contact Finish - Mating: Tin; Contact Finish - Post: Tin; Contact Material: Copper Alloy; Contact Shape: Square; Contact Type: Male Pin; Fastening Type: Push-Pull; Features: Solder Retention; Insulation Color: Natural; Insulation Height: 0.114" (2.90mm); Insulation Material: Polyamide (PA), Nylon; LastUpdated: 12.01.2020 23:41:52; Lifecycle Status: Active; Minimum Order: 1; Mounting Type: Surface Mount, Right Angle; Number of Rows: 1; Operating Temperature: -25°C ~ 85°C; Packaging: TapeAndReel; PartId: 62; Part Status: Active; Price: 0.26; Series: SR; Supplier 1: DigiKey; Supplier Part Number 1: 455-1804-1-ND; Termination: Solder
J6 = TBS Unify PRO32 HV 5G8: Video transmitter

## Nets that join several sheets
+3V3: Power (5 pins), Sensors (14 pins), MCU (20 pins)
+5V: Power (5 pins), ESC (6 pins), Sensors (J3.1), Video (6 pins)
GND: Power (29 pins), ESC (7 pins), Sensors (12 pins), MCU (27 pins), Video (18 pins)
VBAT: Power (5 pins), ESC (R22.2)
VBAT_VTX: Power (C1.2 IC1.D), Video (8 pins)
VIN: Power (8 pins), ESC (J2.8)
CURRENT_ADC: ESC (C19.1 R21.1), MCU (U3.11)
DSHOT0: ESC (R17.2), MCU (U3.14)
DSHOT1: ESC (R18.2), MCU (U3.25)
DSHOT2: ESC (R19.2), MCU (U3.42)
DSHOT3: ESC (R20.2), MCU (U3.41)
I2C1_SCL: Sensors (R30.1 U2.2), MCU (U3.61)
I2C1_SDA: Sensors (R29.1 U2.4), MCU (U3.62)
I2C2_SCL: Sensors (J3.4 R27.2), MCU (U3.28)
I2C2_SDA: Sensors (J3.5 R28.2), MCU (U3.29)
NetR6_1: Power (R6.1 R7.1), MCU (U3.3)
SPI2_CS: Sensors (IC4.22), MCU (U3.33)
SPI2_MISO: Sensors (IC4.9), MCU (U3.35)
SPI2_MOSI: Sensors (IC4.24), MCU (U3.36)
SPI2_SCK: Sensors (IC4.23), MCU (U3.34)
UART5_RX: ESC (R16.2), MCU (U3.54)
USART1_TX: MCU (U3.58), Video (J6.1)
USART2_RX: Sensors (R26.1), MCU (U3.17)
USART2_TX: Sensors (R25.1), MCU (U3.16)
USART3_RX: MCU (U3.52), Video (J8.2)
USART3_TX: MCU (U3.51), Video (J8.3)
USART6_RX: MCU (U3.38), Video (J7.2)
USART6_TX: MCU (U3.37), Video (J7.3)
USB_D_N: Power (D3.6), MCU (U3.44)
USB_D_P: Power (D3.4), MCU (U3.45)
VBAT_ADC: ESC (C20.2 R23.2), MCU (U3.8)